# Altium schematic sheet bldc_robot_main_adapter_board.SchDoc
size A3
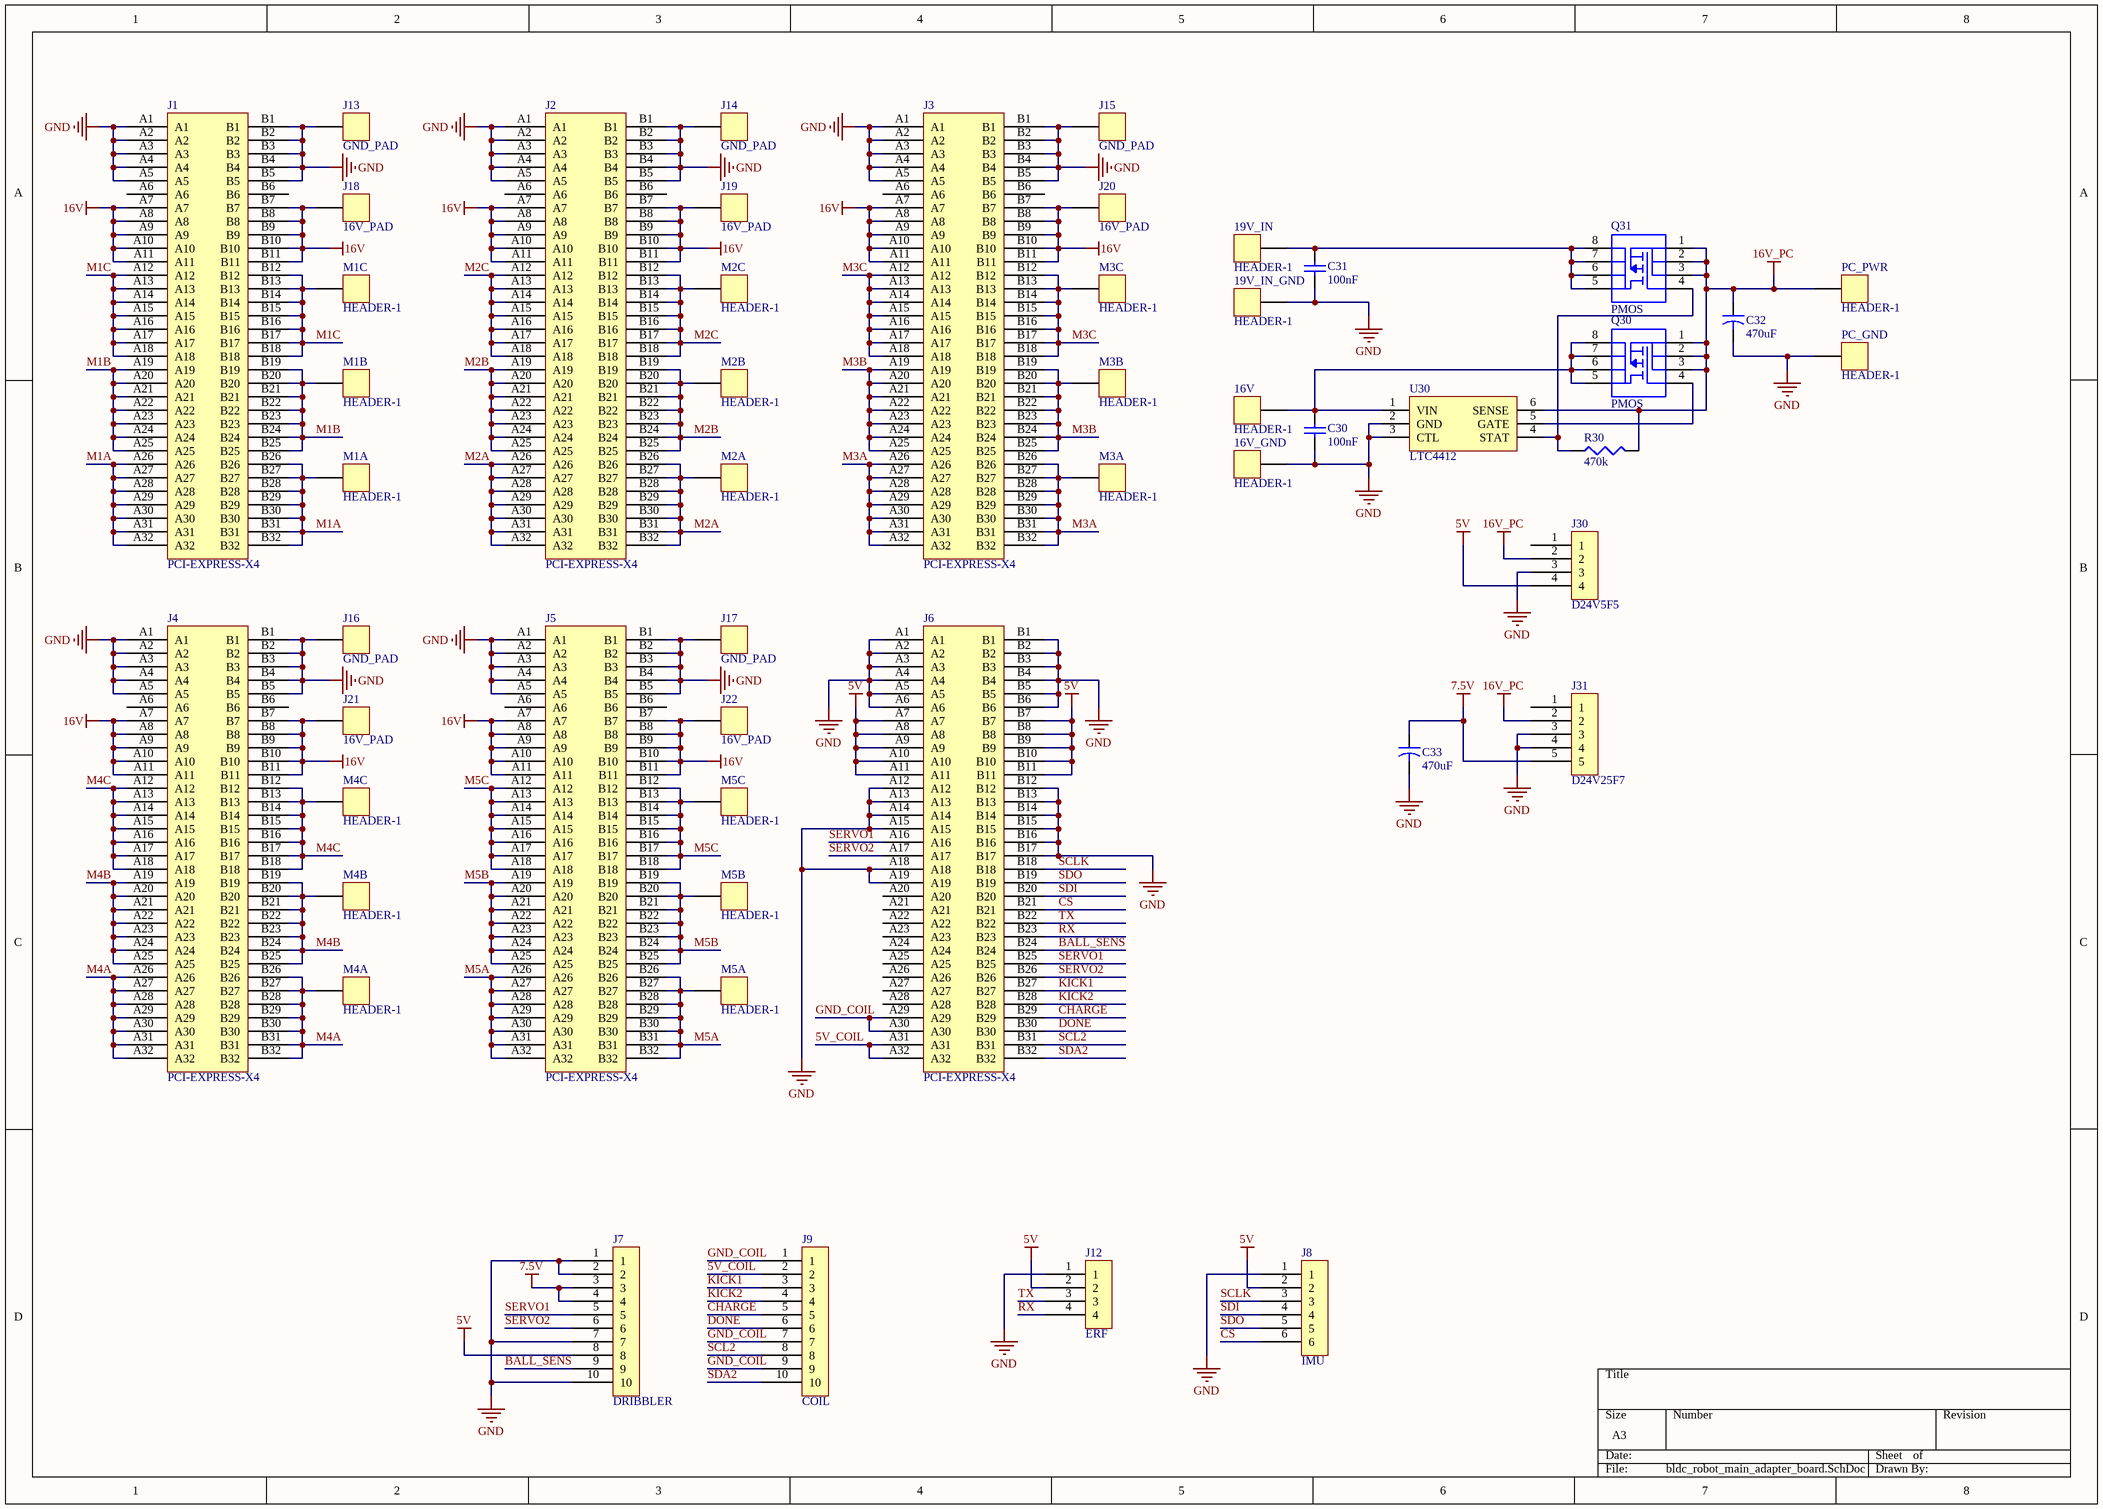
[diagram p0: bldc_robot_main_adapter_board.SchDoc]

## Parts
16V  HEADER-1  [POWER-VIA]
16V_GND  HEADER-1  [POWER-VIA]
19V_IN  HEADER-1  [POWER-VIA]
19V_IN_GND  HEADER-1  [POWER-VIA]
C30  100nF  [1608[0603]]
C31  100nF  [1608[0603]]
C32  470uF  [CAPR5-4X5]
C33  470uF  [CAPR5-4X5]
J1  PCI-EXPRESS-X4  [PCI-EXPRESS-X4-SOCKET]
J2  PCI-EXPRESS-X4  [PCI-EXPRESS-X4-SOCKET]
J3  PCI-EXPRESS-X4  [PCI-EXPRESS-X4-SOCKET]
J4  PCI-EXPRESS-X4  [PCI-EXPRESS-X4-SOCKET]
J5  PCI-EXPRESS-X4  [PCI-EXPRESS-X4-SOCKET]
J6  PCI-EXPRESS-X4  [PCI-EXPRESS-X4-SOCKET]
J7  DRIBBLER  [MICRO-MATCH-10]
J8  IMU  [MICRO-MATCH-6]
J9  COIL  [MICRO-MATCH-10]
J12  ERF  [MICRO-MATCH-4]
J13  GND_PAD  [POWER-PAD]
J14  GND_PAD  [POWER-PAD]
J15  GND_PAD  [POWER-PAD]
J16  GND_PAD  [POWER-PAD]
J17  GND_PAD  [POWER-PAD]
J18  16V_PAD  [POWER-PAD]
J19  16V_PAD  [POWER-PAD]
J20  16V_PAD  [POWER-PAD]
J21  16V_PAD  [POWER-PAD]
J22  16V_PAD  [POWER-PAD]
J30  D24V5F5  [PIN-HEADER-4]
J31  D24V25F7  [PIN-HEADER-5]
M1A  HEADER-1  [2MM-BULLET-VIA]
M1B  HEADER-1  [2MM-BULLET-VIA]
M1C  HEADER-1  [2MM-BULLET-VIA]
M2A  HEADER-1  [2MM-BULLET-VIA]
M2B  HEADER-1  [2MM-BULLET-VIA]
M2C  HEADER-1  [2MM-BULLET-VIA]
M3A  HEADER-1  [2MM-BULLET-VIA]
M3B  HEADER-1  [2MM-BULLET-VIA]
M3C  HEADER-1  [2MM-BULLET-VIA]
M4A  HEADER-1  [2MM-BULLET-VIA]
M4B  HEADER-1  [2MM-BULLET-VIA]
M4C  HEADER-1  [2MM-BULLET-VIA]
M5A  HEADER-1  [2MM-BULLET-VIA]
M5B  HEADER-1  [2MM-BULLET-VIA]
M5C  HEADER-1  [2MM-BULLET-VIA]
PC_GND  HEADER-1  [POWER-VIA]
PC_PWR  HEADER-1  [POWER-VIA]
Q30  PMOS  [SO8]
Q31  PMOS  [SO8]
R30  470k  [J1-0603]
U30  LTC4412  [TSOT-23-6]

## Nets
5V: J6.A7 J6.A8 J6.A9 J6.A10 J6.A11 J6.B7 J6.B8 J6.B9 J6.B10 J6.B11 J7.8 J8.2 J12.2 J30.4
7.5V: C33.1 J7.3 J7.4 J31.5
16V: J1.A7 J1.A8 J1.A9 J1.A10 J1.A11 J1.B7 J1.B8 J1.B9 J1.B10 J1.B11 J2.A7 J2.A8 J2.A9 J2.A10 J2.A11 J2.B7 J2.B8 J2.B9 J2.B10 J2.B11 J3.A7 J3.A8 J3.A9 J3.A10 J3.A11 J3.B7 J3.B8 J3.B9 J3.B10 J3.B11 J4.A7 J4.A8 J4.A9 J4.A10 J4.A11 J4.B7 J4.B8 J4.B9 J4.B10 J4.B11 J5.A7 J5.A8 J5.A9 J5.A10 J5.A11 J5.B7 J5.B8 J5.B9 J5.B10 J5.B11 J18.1 J19.1 J20.1 J21.1 J22.1
16V_PC: C32.1 J30.2 J31.2 PC_PWR.1 Q30.1 Q30.2 Q30.3 Q31.1 Q31.2 Q31.3 R30.2 U30.6(SENSE)
GND: 16V_GND.1 19V_IN_GND.1 C30.2 C31.2 C32.2 C33.2 J1.A1 J1.A2 J1.A3 J1.A4 J1.A5 J1.B1 J1.B2 J1.B3 J1.B4 J1.B5 J2.A1 J2.A2 J2.A3 J2.A4 J2.A5 J2.B1 J2.B2 J2.B3 J2.B4 J2.B5 J3.A1 J3.A2 J3.A3 J3.A4 J3.A5 J3.B1 J3.B2 J3.B3 J3.B4 J3.B5 J4.A1 J4.A2 J4.A3 J4.A4 J4.A5 J4.B1 J4.B2 J4.B3 J4.B4 J4.B5 J5.A1 J5.A2 J5.A3 J5.A4 J5.A5 J5.B1 J5.B2 J5.B3 J5.B4 J5.B5 J6.A1 J6.A2 J6.A3 J6.A4 J6.A5 J6.A6 J6.A12 J6.A13 J6.A14 J6.A15 J6.A18 J6.A19 J6.B1 J6.B2 J6.B3 J6.B4 J6.B5 J6.B6 J6.B12 J6.B13 J6.B14 J6.B15 J6.B16 J6.B17 J7.1 J7.2 J7.7 J7.10 J8.1 J12.1 J13.1 J14.1 J15.1 J16.1 J17.1 J30.3 J31.3 J31.4 PC_GND.1 U30.2(GND) U30.3(CTL)
5V_COIL: J6.A31 J6.A32 J9.2
BALL_SENS: J6.B24 J7.9
CHARGE: J6.B29 J9.5
CS: J6.B21 J8.6
DONE: J6.B30 J9.6
GND_COIL: J6.A29 J6.A30 J9.1 J9.7 J9.9
KICK1: J6.B27 J9.3
KICK2: J6.B28 J9.4
M1A: J1.A26 J1.A27 J1.A28 J1.A29 J1.A30 J1.A31 J1.A32 J1.B26 J1.B27 J1.B28 J1.B29 J1.B30 J1.B31 J1.B32 M1A.1
M1B: J1.A19 J1.A20 J1.A21 J1.A22 J1.A23 J1.A24 J1.A25 J1.B19 J1.B20 J1.B21 J1.B22 J1.B23 J1.B24 J1.B25 M1B.1
M1C: J1.A12 J1.A13 J1.A14 J1.A15 J1.A16 J1.A17 J1.A18 J1.B12 J1.B13 J1.B14 J1.B15 J1.B16 J1.B17 J1.B18 M1C.1
M2A: J2.A26 J2.A27 J2.A28 J2.A29 J2.A30 J2.A31 J2.A32 J2.B26 J2.B27 J2.B28 J2.B29 J2.B30 J2.B31 J2.B32 M2A.1
M2B: J2.A19 J2.A20 J2.A21 J2.A22 J2.A23 J2.A24 J2.A25 J2.B19 J2.B20 J2.B21 J2.B22 J2.B23 J2.B24 J2.B25 M2B.1
M2C: J2.A12 J2.A13 J2.A14 J2.A15 J2.A16 J2.A17 J2.A18 J2.B12 J2.B13 J2.B14 J2.B15 J2.B16 J2.B17 J2.B18 M2C.1
M3A: J3.A26 J3.A27 J3.A28 J3.A29 J3.A30 J3.A31 J3.A32 J3.B26 J3.B27 J3.B28 J3.B29 J3.B30 J3.B31 J3.B32 M3A.1
M3B: J3.A19 J3.A20 J3.A21 J3.A22 J3.A23 J3.A24 J3.A25 J3.B19 J3.B20 J3.B21 J3.B22 J3.B23 J3.B24 J3.B25 M3B.1
M3C: J3.A12 J3.A13 J3.A14 J3.A15 J3.A16 J3.A17 J3.A18 J3.B12 J3.B13 J3.B14 J3.B15 J3.B16 J3.B17 J3.B18 M3C.1
M4A: J4.A26 J4.A27 J4.A28 J4.A29 J4.A30 J4.A31 J4.A32 J4.B26 J4.B27 J4.B28 J4.B29 J4.B30 J4.B31 J4.B32 M4A.1
M4B: J4.A19 J4.A20 J4.A21 J4.A22 J4.A23 J4.A24 J4.A25 J4.B19 J4.B20 J4.B21 J4.B22 J4.B23 J4.B24 J4.B25 M4B.1
M4C: J4.A12 J4.A13 J4.A14 J4.A15 J4.A16 J4.A17 J4.A18 J4.B12 J4.B13 J4.B14 J4.B15 J4.B16 J4.B17 J4.B18 M4C.1
M5A: J5.A26 J5.A27 J5.A28 J5.A29 J5.A30 J5.A31 J5.A32 J5.B26 J5.B27 J5.B28 J5.B29 J5.B30 J5.B31 J5.B32 M5A.1
M5B: J5.A19 J5.A20 J5.A21 J5.A22 J5.A23 J5.A24 J5.A25 J5.B19 J5.B20 J5.B21 J5.B22 J5.B23 J5.B24 J5.B25 M5B.1
M5C: J5.A12 J5.A13 J5.A14 J5.A15 J5.A16 J5.A17 J5.A18 J5.B12 J5.B13 J5.B14 J5.B15 J5.B16 J5.B17 J5.B18 M5C.1
RX: J6.B23 J12.4
SCL2: J6.B31 J9.8
SCLK: J6.B18 J8.3
SDA2: J6.B32 J9.10
SDI: J6.B20 J8.4
SDO: J6.B19 J8.5
SERVO1: J6.A16 J6.B25 J7.5
SERVO2: J6.A17 J6.B26 J7.6
TX: J6.B22 J12.3
Net16V_1: 16V.1 C30.1 Q30.5 Q30.6 Q30.7 Q30.8 U30.1(VIN)
Net19V_IN_1: 19V_IN.1 C31.1 Q31.5 Q31.6 Q31.7 Q31.8
NetQ30_4: Q30.4 U30.5(GATE)
NetQ31_4: Q31.4 R30.1 U30.4(STAT)

Not connected (* = marked no-connect by the designer): J1 A6 B6; J2 A6 B6; J3 A6 B6; J4 A6 B6; J5 A6 B6; J6 A20 A21 A22 A23 A24 A25 A26 A27 A28; J30 1; J31 1

## Library data of the parts
C30 C31 = Cap Semi: Capacitor (Semiconductor SIM Model); Value: 100pF; Published: 8-Jun-2000; LatestRevisionDate: 29-May-2009; LatestRevisionNote: IPC-7351 Footprint Added.; PackageReference: C1206; Publisher: Altium Limited; PackageDescription: Chip Capacitor
C32 C33 = Cap2: Capacitor; Value: 100pF; Published: 23-Sep-2002; PackageReference: CAPR5-4X5; Publisher: Altium Limited; PackageDescription: Capacitor; 2 Leads
J7 J9 = HEADER-10
J8 = HEADER-6
J12 J30 = HEADER-4
J13-J22 = HEADER-1
J31 = HEADER-5
R30 = Res3: Resistor; Value: 1K; Published: 8-Jun-2000; LatestRevisionDate: 29-May-2009; LatestRevisionNote: IPC-7351 Footprint Added.; PackageReference: J1-0603; Publisher: Altium Limited; PackageDescription: Chip Resistor